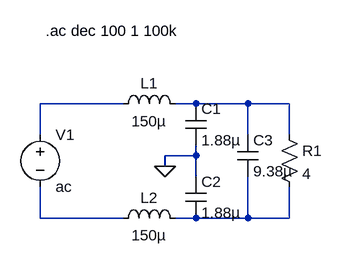
[diagram p0: schematic trans.asc]
trans.asc, the LTspice schematic file:
Version 4
SHEET 1 880 680
WIRE 304 96 176 96
WIRE 416 96 384 96
WIRE 496 96 416 96
WIRE 560 96 496 96
WIRE 176 144 176 96
WIRE 496 144 496 96
WIRE 560 144 560 96
WIRE 416 176 416 160
WIRE 416 176 368 176
WIRE 368 192 368 176
WIRE 416 208 416 176
WIRE 176 272 176 224
WIRE 304 272 176 272
WIRE 416 272 384 272
WIRE 496 272 496 208
WIRE 496 272 416 272
WIRE 560 272 560 224
WIRE 560 272 496 272
FLAG 368 192 0
SYMBOL ind 288 112 R270
WINDOW 0 32 56 VTop 2
WINDOW 3 5 56 VBottom 2
SYMATTR InstName L1
SYMATTR Value 150µ
SYMBOL ind 288 288 R270
WINDOW 0 32 56 VTop 2
WINDOW 3 5 56 VBottom 2
SYMATTR InstName L2
SYMATTR Value 150µ
SYMBOL cap 400 96 R0
SYMATTR InstName C1
SYMATTR Value 1.88µ
SYMBOL cap 400 208 R0
SYMATTR InstName C2
SYMATTR Value 1.88µ
SYMBOL cap 480 144 R0
SYMATTR InstName C3
SYMATTR Value 9.38µ
SYMBOL res 544 128 R0
SYMATTR InstName R1
SYMATTR Value 4
SYMBOL voltage 176 128 R0
WINDOW 123 0 0 Left 0
WINDOW 39 0 0 Left 0
SYMATTR InstName V1
SYMATTR Value ac
TEXT 184 -16 Left 2 !.ac dec 100 1 100k

The netlist it stands for:
* trans.asc
L1 N001 N002 150µ
L2 N003 N004 150µ
C1 N002 0 1.88µ
C2 0 N004 1.88µ
C3 N002 N004 9.38µ
R1 N002 N004 4
V1 N001 N003 ac
.ac dec 100 1 100k
.backanno
.end